# EAGLE design arm-tagconnect (EAGLE 6.5.0)
AUTHOR: Brad Campbell; REV: a; TITLE: ARM-to-TAGCONNECT
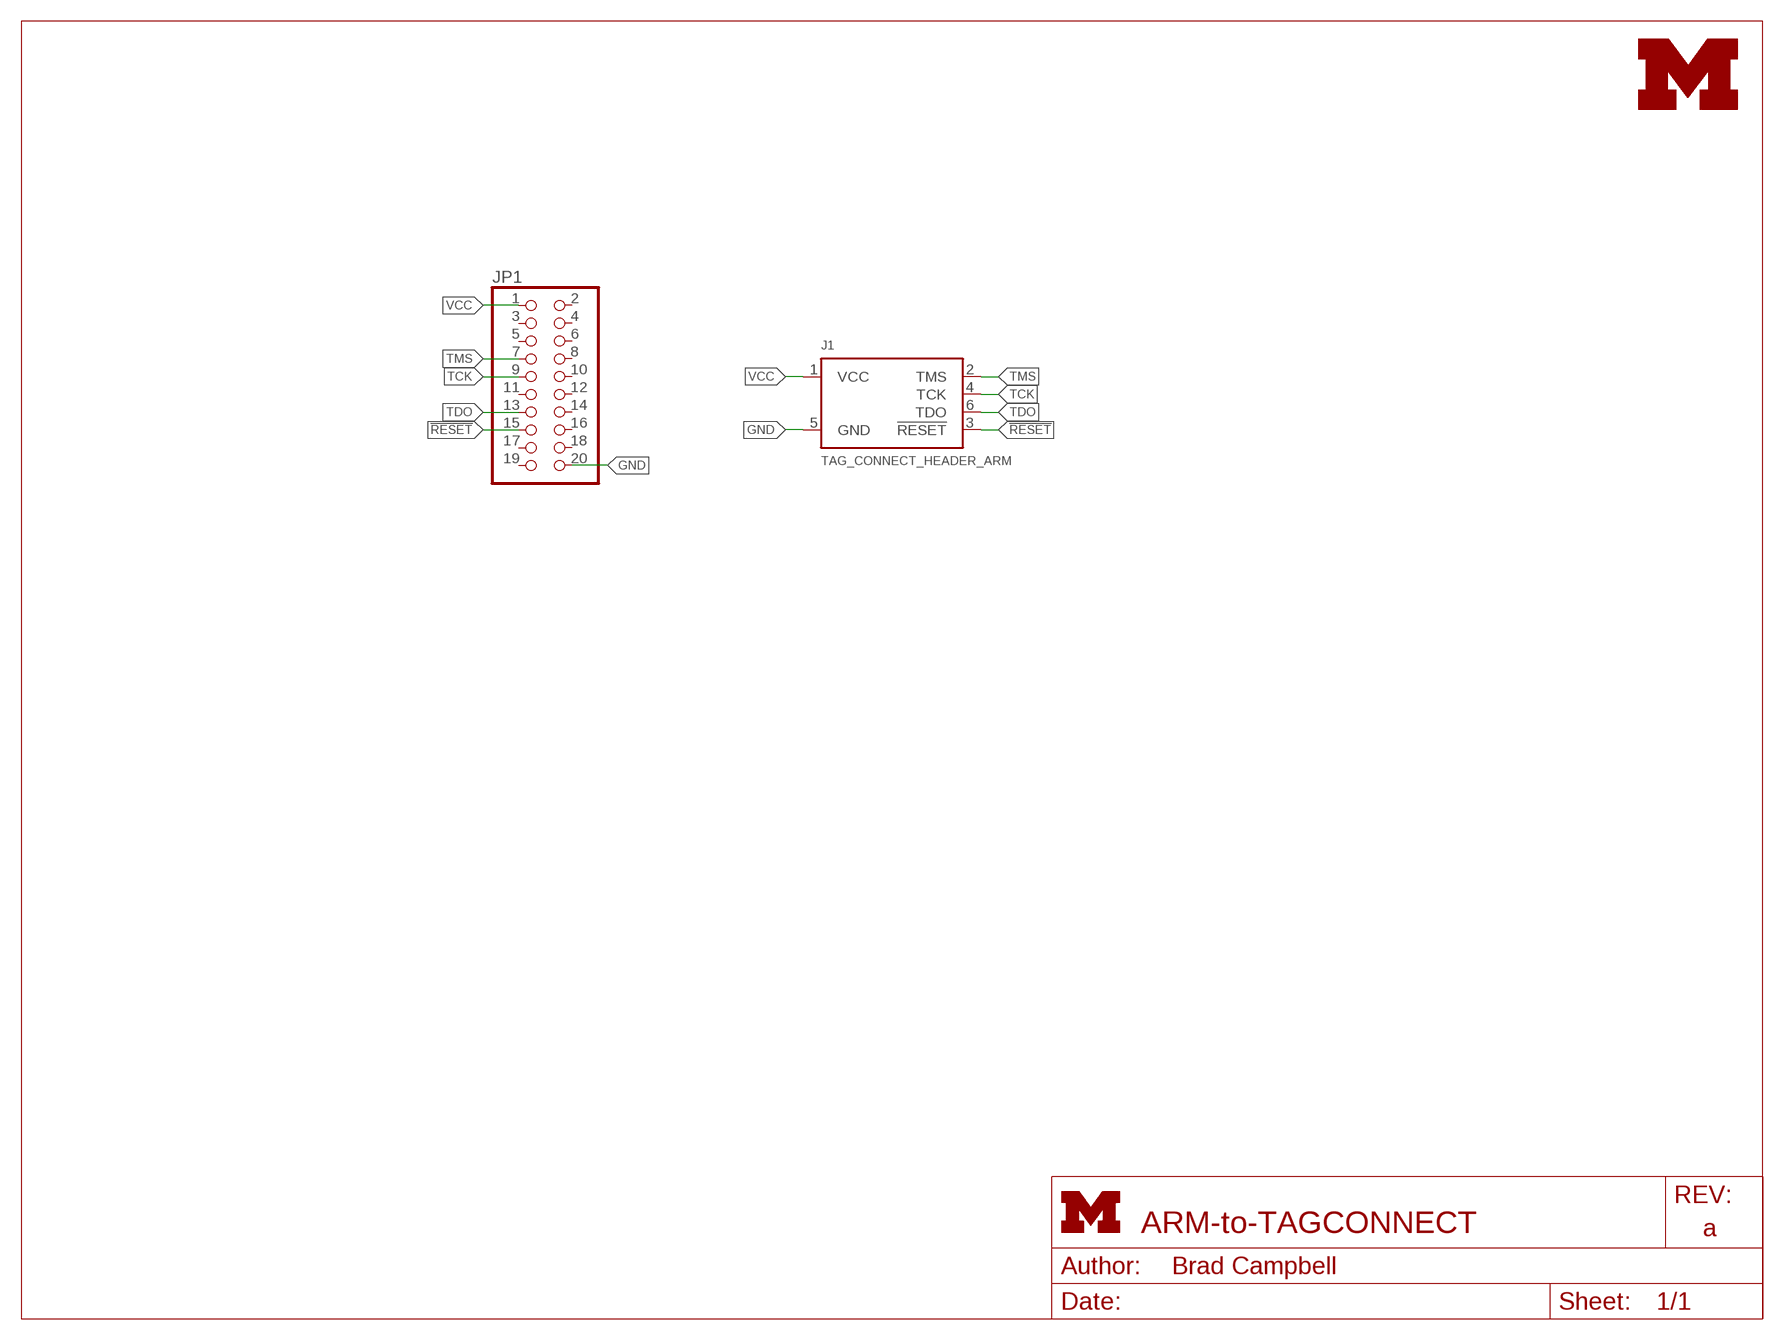
[diagram p0: schematic, sheet 1]
FRAME1 (LETTER_L): HEIGHT: 8.5in; WIDTH: 11in

## Parts
J1  TAG_CONNECT_HEADER_ARM  [2X3_MALE_SHROUDED_0.100]
JP1  PINHD-2X10  [2X10]
LOGO1  UMICH_SOLID_SMALL  [UMICH_SOLID_75MIL]

## Nets
!RESET: J1.3(!RESET) JP1.15
GND: J1.5(GND) JP1.20
TCK: J1.4(TCK) JP1.9
TDO: J1.6(TDO) JP1.13
TMS: J1.2(TMS) JP1.7
VCC: J1.1(VCC) JP1.1
Unconnected: JP1.2 JP1.3 JP1.4 JP1.5 JP1.6 JP1.8 JP1.10 JP1.11 JP1.12 JP1.14 JP1.16 JP1.17 JP1.18 JP1.19

## Library data of the parts
J1 = headers:TAG_CONNECT_HEADER_ARM: Tag Connect footprint for ARM JTAG. 10 pin ARM Cortex Debug Connector.
JP1 = pinhead:PINHD-2X10: PIN HEADER
LOGO1 = logos:UMICH_SOLID

## Board
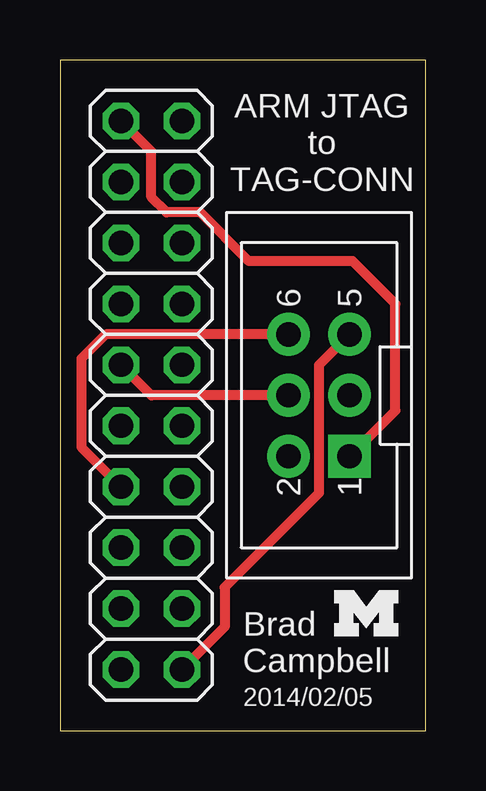
[diagram p1: board, top side]
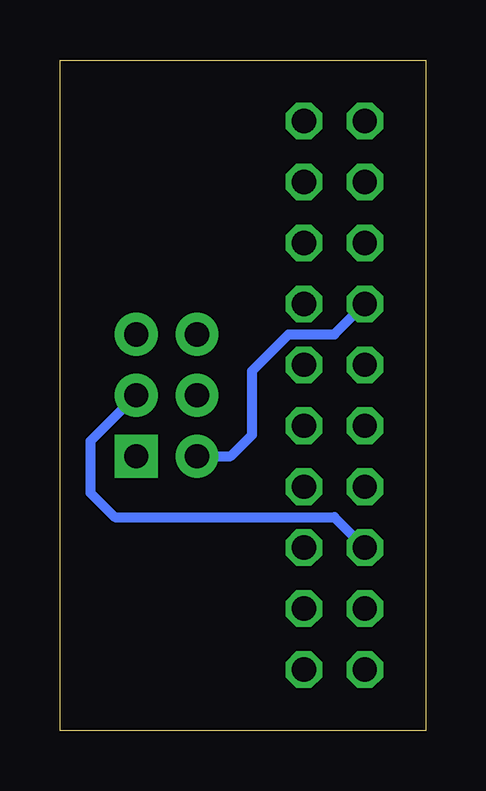
[diagram p2: board, bottom side, seen from below]

Size 15.24 x 27.94 mm. Coordinates in mm from the lower left corner, seen from the top.
Outline: 0,0 15.24,0 15.24,27.94 0,27.94 0,0
Copper layers (1*16): Top 0.0178mm / dielectric 59mil / Bottom 0.0178mm
Design rules "sunstone-2lyr_v1.0.0.3": minimum track width 6mil, minimum drill 14mil, track to track 6mil, track to pad 6mil, pad to pad 6mil, via to via 6mil, smd to smd 6mil, copper to edge 20mil, drill to drill 16mil, minimum pad ring 8mil, minimum via ring 8mil, stop-mask expansion 3mil, vias tented up to drill 0mil, thermal gap 10mil

### Footprints (pad centres in the part's own frame; a part is rotated, then mirrored left to right if it is on the bottom)
2X3_MALE_SHROUDED_0.100 = drill 1.016 pad 1.778 square: 1 -2.54,-1.27 | drill 1.016 pad 1.778: 2 -2.54,1.27; 3 0,-1.27; 4 0,1.27; 5 2.54,-1.27; 6 2.54,1.27
2X10 = drill 1.016 octagon: 1 -11.43,-1.27; 2 -11.43,1.27; 3 -8.89,-1.27; 4 -8.89,1.27; 5 -6.35,-1.27; 6 -6.35,1.27; 7 -3.81,-1.27; 8 -3.81,1.27; 9 -1.27,-1.27; 10 -1.27,1.27; 11 1.27,-1.27; 12 1.27,1.27; 13 3.81,-1.27; 14 3.81,1.27; 15 6.35,-1.27; 16 6.35,1.27; 17 8.89,-1.27; 18 8.89,1.27; 19 11.43,-1.27; 20 11.43,1.27

### Placement (x,y rotation side)
J1  10.79,13.97 90 top
JP1  3.81,13.97 270 top
LOGO1  11.43,3.94 0 top

### Tracks (layer width: path | path; a pad name or v marks a point on that pad's centre or on a via)
!RESET
  Bottom 0.406: J1.3 13.97,12.06 13.97,9.91 12.95,8.89 3.81,8.89 JP1.15
GND
  Top 0.406: J1.5 10.79,15.24 10.79,9.91 6.86,5.97 6.86,4.32 JP1.20
TCK
  Top 0.406: J1.4 3.81,13.97 JP1.9
TDO
  Top 0.406: J1.6 1.91,16.51 0.89,15.49 0.89,11.81 JP1.13
TMS
  Bottom 0.406: J1.2 8.13,11.43 7.24,12.32 7.24,14.99 5.71,16.51 3.81,16.51 JP1.7
VCC
  Top 0.406: J1.1 13.97,13.34 13.97,17.78 12.19,19.56 7.87,19.56 5.84,21.59 4.45,21.59 3.81,22.23 3.81,24.13 JP1.1

### Text on the board
tPlace: ARM JTAG / to / TAG-CONN | Brad / Campbell | 2014/02/05